# Altium project LightBoard.PrjPcb
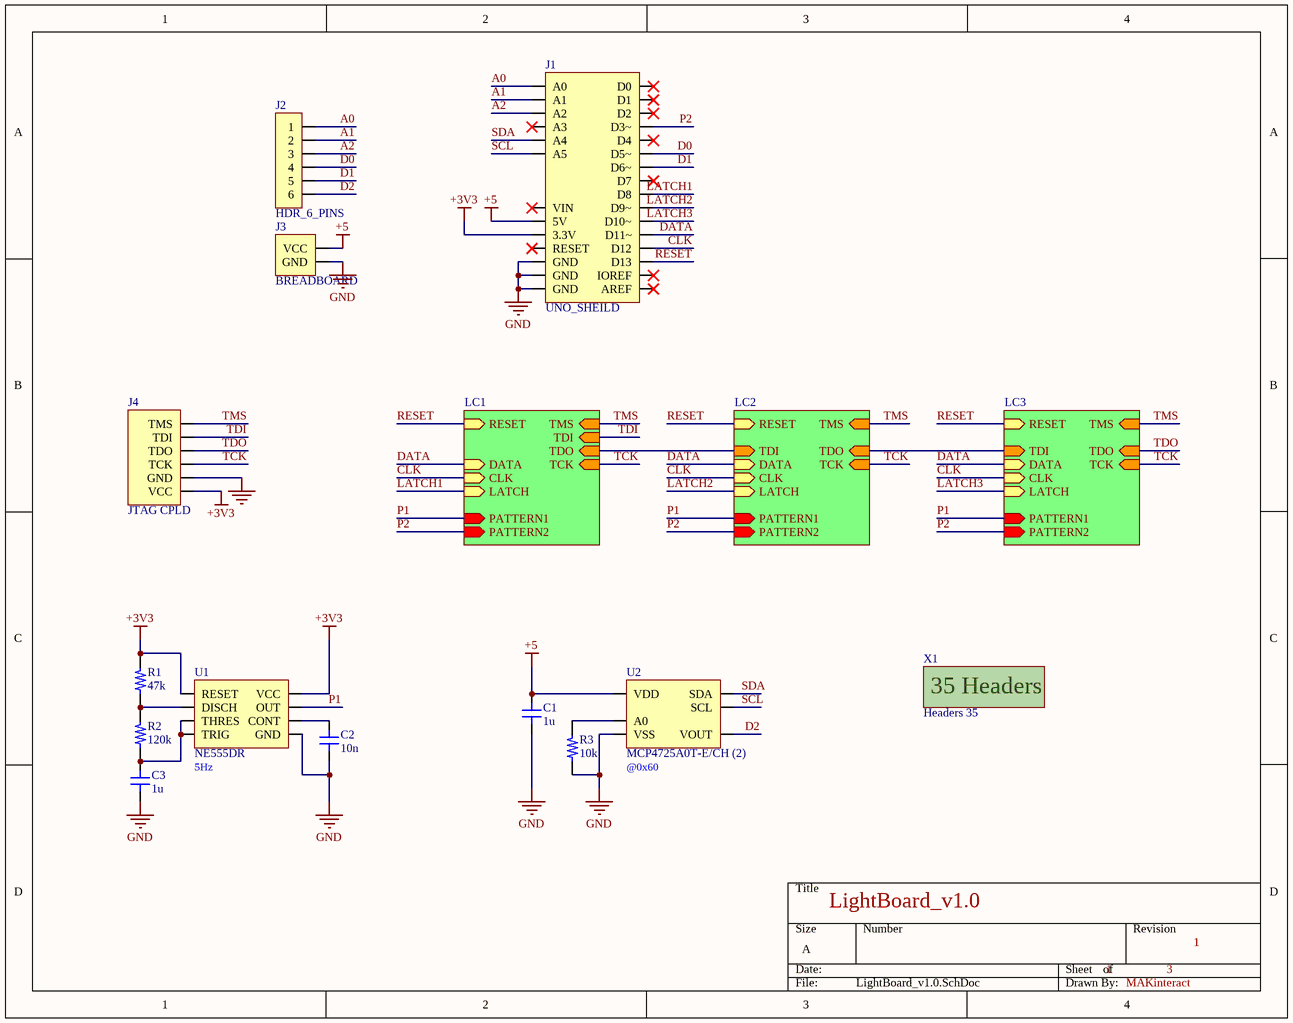
[diagram p0: LightBoard_v1.0.SchDoc]
2 sheets, 145 parts. Net scope: hierarchical (ports join the sheet entries above them; power ports are global).
Board file: LightBoard_v1.0.PcbDoc
Sheets:
  LightBoard_v1.0.SchDoc
    LC1 = LEDcontroller.SchDoc
    LC2 = LEDcontroller.SchDoc
    LC3 = LEDcontroller.SchDoc

## Sheet LightBoard_v1.0.SchDoc
size A; Author: MAKinteract; Revision: 1; SheetNumber: 1; SheetTotal: 3

### Parts
C1  1u
C2  10n
C3  1u
J1  UNO_SHEILD  [ARDUINO_UNO_SHIELD]  (mechanical)
J2  HDR_6_PINS  (mechanical)
J3  BREADBOARD  (mechanical)
J4  JTAG CPLD  (mechanical)
R1  47k
R2  120k
R3  10k
U1  NE555DR
U2  MCP4725A0T-E/CH (2)  [SOT23-6]
X1  Headers 35

### Sub-sheets
LC1 = LEDcontroller.SchDoc: PATTERN1 (in), RESET (in), CLK (in), PATTERN2 (in), TDI (in), TMS (in), TDO (in), TCK (in), DATA (in), LATCH (in)
LC2 = LEDcontroller.SchDoc: PATTERN1 (in), RESET (in), CLK (in), PATTERN2 (in), TDI (in), TMS (in), TDO (in), TCK (in), DATA (in), LATCH (in)
LC3 = LEDcontroller.SchDoc: PATTERN1 (in), RESET (in), CLK (in), PATTERN2 (in), TDI (in), TMS (in), TDO (in), TCK (in), DATA (in), LATCH (in)

### Nets
+3V3: J1.27(3.3V) J4.6(VCC) R1.2 U1.4(RESET) U1.8(VCC)
+5: C1.2 J1.26(5V) J3.1(VCC) U2.3(VDD)
GND: C1.1 C2.1 C3.1 J1.15(GND) J1.24(GND) J1.25(GND) J3.2(GND) J4.5(GND) R3.1 U1.1(GND) U2.2(VSS)
A0: J1.22(A0) J2.1
A1: J1.21(A1) J2.2
A2: J1.20(A2) J2.3
CLK: J1.13(D12) ; sheet LC1/CLK, sheet LC2/CLK, sheet LC3/CLK
D0: J1.6(D5~) J2.4
D1: J1.7(D6~) J2.5
D2: J2.6 U2.1(VOUT)
DATA: J1.12(D11~) ; sheet LC1/DATA, sheet LC2/DATA, sheet LC3/DATA
LATCH1: J1.9(D8) ; sheet LC1/LATCH
LATCH2: J1.10(D9~) ; sheet LC2/LATCH
LATCH3: J1.11(D10~) ; sheet LC3/LATCH
P1: U1.3(OUT) ; sheet LC1/PATTERN1, sheet LC2/PATTERN1, sheet LC3/PATTERN1
P2: J1.4(D3~) ; sheet LC1/PATTERN2, sheet LC2/PATTERN2, sheet LC3/PATTERN2
RESET: J1.14(D13) ; sheet LC1/RESET, sheet LC2/RESET, sheet LC3/RESET
SCL: J1.17(A5) U2.5(SCL)
SDA: J1.18(A4) U2.4(SDA)
TCK: J4.4(TCK) ; sheet LC1/TCK, sheet LC2/TCK, sheet LC3/TCK
TDI: J4.2(TDI) ; sheet LC1/TDI
TDO: J4.3(TDO) ; sheet LC3/TDO
TMS: J4.1(TMS) ; sheet LC1/TMS, sheet LC2/TMS, sheet LC3/TMS
NetC2_2: C2.2 U1.5(CONT)
NetC3_2: C3.2 R2.1 U1.2(TRIG) U1.6(THRES)
NetR1_1: R1.1 R2.2 U1.7(DISCH)
NetR3_2: R3.2 U2.6(A0)
NetU3A_24: sheet LC1/TDO, sheet LC2/TDI
NetU3B_24: sheet LC2/TDO, sheet LC3/TDI

Not connected (* = marked no-connect by the designer): J1 1(D0)* 2(D1)* 3(D2)* 5(D4)* 8(D7)* 16(AREF)* 19(A3)* 23(VIN)* 28(RESET)* 29(IOREF)*

### Notes on the sheet
- (near U1) 5Hz
- (near U2) @0x60
- LightBoard_v1.0
- (in symbol M_Headers35) 35 Headers

### Library data of the parts
C1 C3 = C0805_1u: CERAMIC CAPACITOR, 1UF, 25V, Y5V, +80, -20%, 0805, FULL REEL; Product Range:CC Series; Capacitance:1 F; Capacitance Tolerance:+80%, -20%; Dielectric Characteristic:Y5V; Voltage Rating:25V; Ceramic Capacitor Case:0805 [2012 Metric] ;RoHS Compliant: Yes; Manufacturer: Yageo; Manufacturer Part Number: CC0805ZRY5V8BB105; Tolerance: 80%; Supplier 1: Digi-Key; Stock 1: 144647; RoHS: Yes; Mount: Surface Mount; Case/Package: 0805; Weight: 0.000194oz; Case Code (Metric): 2012; Case Code (Imperial): 0805; Min Operating Temperature: -30°C; Max Operating Temperature: 85°C; Package Quantity: 1; Capacitance: 1uF; Voltage Rating: 25V; Packaging: Tape and Reel; Voltage Rating (DC): 25V; Dielectric: Y5V; Termination: SMD/SMT; Composition: Ceramic; Length: 2mm; Height: 0.85mm; Width: 0.049inch; Thickness: 0.033inch; Depth: 1.25mm; Radiation Hardening: No; REACH SVHC: No SVHC; Lead Free: Lead Free; Halogen Free: Halogen Free; ComponentLink6URL: https://datasheet.ciiva.com/28450/1132289-28450860.pdf?src-supplier=Element14; ComponentLink6Description: https://datasheet.ciiva.com/28450/1132289-28450860.pdf?src-supplier=Element14; Supplier Part Number 1: 311-1358-6-ND; Pricing 1: 1 = 0.16000, 10 = 0.11400, 100 = 0.05340, 500 = 0.03748, 1000 = 0.03102 (USD)
C2 = C0402_10n: Cap Ceramic 0.01uF 10V X7R 10% SMD 0402 125C Paper T/R; Manufacturer: Yageo; Manufacturer Part Number: CC0402KRX7R6BB103; Capacitance: 10nF; Supplier 1: Digi-Key; Stock 1: 16677; RoHS: Yes; Mount: Surface Mount; Case/Package: 0402; Weight: 2.3E-05oz; Case Code (Imperial): 0402; Case Code (Metric): 1005; Min Operating Temperature: -55°C; Max Operating Temperature: 125°C; Packaging: Tape and Reel; Tolerance: 10%; Voltage Rating (DC): 10V; Dielectric: X7R; Termination: SMD/SMT; Composition: Ceramic; Voltage Rating: 10V; Length: 1mm; Width: 0.02inch; Thickness: 0.022inch; Depth: 0.5mm; Radiation Hardening: No; Lead Free: Lead Free; Halogen Free: Halogen Free; ComponentLink1URL: https://datasheet.ciiva.com/26862/getdatasheetpartid-748492-26862629.pdf?src-supplier=Verical; ComponentLink1Description: https://datasheet.ciiva.com/26862/getdatasheetpartid-748492-26862629.pdf?src-supplier=Verical; Supplier Part Number 1: 311-1703-6-ND; Pricing 1: 1 = 0.10000, 10 = 0.02100, 100 = 0.00950, 500 = 0.00678, 1000 = 0.00532, 2500 = 0.00484, 5000 = 0.00445 (USD)
J1 = ARDUINO_UNO_SHIELD: Arduino UNO shield; Manufacturer Part Number: A000073; Evaluation Kit: Yes; Number of Bits: 8; Core Architecture: AVR; Supplier 1: Digi-Key; Manufacturer: Arduino; Stock 1: 2726; RoHS: Yes; Mount: Surface Mount; Weight: 0.02lb; Package Quantity: 1; Packaging: Bulk; Length: 3inch; Height: 0.05inch; Width: 2.5inch; REACH SVHC: Unknown; ComponentLink6URL: https://datasheet.ciiva.com/20168/73-4443-20168541.pdf?src-supplier=Rapid+Electronics; ComponentLink6Description: https://datasheet.ciiva.com/20168/73-4443-20168541.pdf?src-supplier=Rapid+Electronics; Supplier Part Number 1: 1050-1041-ND; Pricing 1: 1 = 20.90000 (USD)
J2 = H_ARDUPINS: Sockets to connect to Arduino pins
J3 = BREADBOARD: 26*2 ROWS
J4 = H_JTAG: Socket to connect to JTAG
R1 = R0402_47K: YAGEO - RC0402JR-0747KL - SMD Chip Resistor, 0402 [1005 Metric], 47 kohm, RC Series, 50 V, Thick Film, 63 mW; Resistance: 47kR; Power Rating: 63mW; Tolerance: 5%; Voltage Rating: 50V; Temperature Coefficient: 100ppm/°C; Supplier 1: Digi-Key; Manufacturer: Yageo; Manufacturer Part Number: RC0402JR-0747KL; Stock 1: 4044309; RoHS: Yes; Case/Package: 0402; Case Code (Metric): 1005; Case Code (Imperial): 0402; Min Operating Temperature: -55°C; Max Operating Temperature: 155°C; Package Quantity: 1; Packaging: Tape and Reel; Composition: Thick Film; Number of Terminations: 2; Termination: SMD/SMT; Military Standard: Not; Max Power Dissipation: 63mW; Features: Moisture Resistant; Working Voltage: 50V; Length: 1mm; Height: 0.016inch; Width: 0.02inch; Depth: 0.5mm; REACH SVHC: Unknown; Lead Free: Lead Free; ComponentLink8URL: https://datasheet.ciiva.com/16740/pyu-rc0402-51-rohs-l-6-r-16740971.pdf?src-supplier=Future+Electronics; ComponentLink8Description: https://datasheet.ciiva.com/16740/pyu-rc0402-51-rohs-l-6-r-16740971.pdf?src-supplier=Future+Electronics; Supplier Part Number 1: 311-47KJRDKR-ND; Pricing 1: 1 = 0.10000, 10 = 0.01300, 100 = 0.00530, 1000 = 0.00236, 2500 = 0.00205, 5000 = 0.00169 (USD)
R2 = R0402_120K: RES SMD 120K OHM 5% 1/16W 0402; Manufacturer: Yageo; Manufacturer Part Number: RC0402JR-07120KL; Resistance: 120kR; Power Rating: 63mW; Voltage Rating: 50V; Temperature Coefficient: 100ppm/°C; Supplier 1: Digi-Key; Stock 1: 102829; RoHS: Yes; Case/Package: 0402; Number of Pins: 2; Case Code (Imperial): 0402; Case Code (Metric): 1005; Min Operating Temperature: -55°C; Max Operating Temperature: 155°C; Tolerance: 5%; Packaging: Tape and Reel; Voltage Rating (DC): 50V; Package Quantity: 10000; Termination: SMD/SMT; Composition: Thick Film; Military Standard: Not; Length: 1mm; Height: 0.35mm; Width: 0.5mm; Depth: 0.5mm; REACH SVHC: No SVHC; Lead Free: Lead Free; ComponentLink1URL: https://datasheet.ciiva.com/7850/1018594-7850140.pdf?src-supplier=Element14; ComponentLink1Description: https://datasheet.ciiva.com/7850/1018594-7850140.pdf?src-supplier=Element14; ComponentLink2URL: https://datasheet.ciiva.com/6168/1018594-6168997.pdf?src-supplier=Farnell; ComponentLink2Description: https://datasheet.ciiva.com/6168/1018594-6168997.pdf?src-supplier=Farnell; ComponentLink3URL: https://datasheet.ciiva.com/7983/1018594-7983545.pdf?src-supplier=Element14; ComponentLink3Description: https://datasheet.ciiva.com/7983/1018594-7983545.pdf?src-supplier=Element14; ComponentLink4URL: https://datasheet.ciiva.com/7850/1018594-7850141.pdf?src-supplier=Element14; ComponentLink4Description: https://datasheet.ciiva.com/7850/1018594-7850141.pdf?src-supplier=Element14; ComponentLink5URL: https://datasheet.ciiva.com/12576/pyu-rc0402-51-rohs-l-6-r-8721-12576174.pdf?src-supplier=Mouser; ComponentLink5Description: https://datasheet.ciiva.com/12576/pyu-rc0402-51-rohs-l-6-r-8721-12576174.pdf?src-supplier=Mouser; Supplier Part Number 1: 311-120KJRDKR-ND; Pricing 1: 1 = 0.10000, 10 = 0.01300, 100 = 0.00530, 1000 = 0.00236, 2500 = 0.00205, 5000 = 0.00169 (USD)
R3 = R0402_10K: RES SMD 10K OHM 1% 1/16W 0402; Manufacturer: Yageo; Manufacturer Part Number: RC0402FR-0710KP; Max Power Dissipation: 63mW; Temperature Coefficient: 150ppm/°C; Resistance: 10kR; Supplier 1: Digi-Key; Stock 1: 24916; RoHS: Yes; Case/Package: 0402; Case Code (Imperial): 0402; Case Code (Metric): 1005; Min Operating Temperature: -55°C; Max Operating Temperature: 155°C; Tolerance: 1%; Packaging: Tape and Reel; Composition: Thick Film; Number of Terminations: 2; Features: Moisture Resistant; Length: 0.039inch; Height: 0.016inch; Width: 0.02inch; ComponentLink1URL: http://www.yageo.com/NewPortal/yageodocoutput?fileName=/pdf/R-Chip/PYu-RC_51_RoHS_P_0.pdf&src-supplier=Digi-Key; ComponentLink1Description: http://www.yageo.com/NewPortal/yageodocoutput?fileName=/pdf/R-Chip/PYu-RC_51_RoHS_P_0.pdf&src-supplier=Digi-Key; Supplier Part Number 1: YAG1249DKR-ND; Pricing 1: 1 = 0.10000, 10 = 0.03500, 100 = 0.01400, 1000 = 0.00631, 2500 = 0.00548, 5000 = 0.00452 (USD)
U1 = 555: TEXAS INSTRUMENTS         NE555DR.             TIMER, SINGLE, 500KHZ, 16V, SOIC-8; Min Supply Voltage: 4.5V; Frequency: 100kHz; Number of Timers/Counters: 1; Operating Supply Current: 10mA; High Level Output Current: -200mA; Low Level Output Current: 200mA; Quiescent Current: 15mA; Supplier 1: Digi-Key; Manufacturer: Texas Instruments; Manufacturer Part Number: NE555DR; Stock 1: 55105; RoHS: Yes; Mount: Surface Mount; Case/Package: SOIC; Number of Pins: 8; Weight: 0.002561oz; Contact Plating: Gold; Min Operating Temperature: 0°C; Max Operating Temperature: 70°C; Max Supply Voltage: 16V; Packaging: Tape and Reel; Package Quantity: 2500; Length: 4.9mm; Height: 1.58mm; Width: 3.91mm; Radiation Hardening: No; REACH SVHC: No SVHC; Lead Free: Lead Free; Supplier Part Number 1: 296-6501-6-ND; Pricing 1: 1 = 0.36000, 10 = 0.27500, 25 = 0.24760, 100 = 0.17100, 250 = 0.14400, 500 = 0.11700, 1000 = 0.09000 (USD); ComponentLink7URL: https://datasheet.ciiva.com/1139/1874740-1139901.pdf?src-supplier=Element14; ComponentLink7Description: https://datasheet.ciiva.com/1139/1874740-1139901.pdf?src-supplier=Element14
U2 = MCP4725A0T: DAC 1-CH Resistor-String 12-bit 6-Pin SOT-23A T/R; Manufacturer: Microchip; Resolution: 12b; Integral Nonlinearity (INL): 14.5LSB; Output Type: Voltage; Interface: I2C,Serial,2-Wire; Settling Time: 6us; Input Offset Voltage (Vos): 1.1mV; Number of Bits: 12; Number of DAC Channels: 1; Max Supply Voltage: 5.5V; Min Supply Voltage: 2.7V; Polarity: Unipolar; Supply Type: Single; Nominal Supply Current: 210uA; Supplier 1: Digi-Key; Manufacturer Part Number: MCP4725A0T-E/CH; Stock 1: 26487; RoHS: Yes; Mount: Surface Mount; Case/Package: SOT-23-6; Number of Pins: 6; Contact Plating: Tin,Matte; Min Operating Temperature: -40°C; Max Operating Temperature: 125°C; Package Quantity: 3000; Packaging: Tape and Reel; Number of Converters: 1; Number of Channels: 1; Number of D/A Converters: 1; Number of Outputs: 1; Termination: SMD/SMT; Length: 3.1mm; Height: 1.3mm; Width: 1.8mm; Radiation Hardening: No; Lead Free: Lead Free; REACH SVHC: No SVHC; ComponentLink10URL: https://datasheet.ciiva.com/1359/22039d-1359789.pdf?src-supplier=Digi-Key; ComponentLink10Description: https://datasheet.ciiva.com/1359/22039d-1359789.pdf?src-supplier=Digi-Key; Supplier Part Number 1: MCP4725A0T-E/CHDKR-ND; Pricing 1: 1 = 0.96000, 25 = 0.80000, 100 = 0.73000 (USD)
X1 = M_Headers35: Conn Header Vert 35POS 2.54MM; Manufacturer: Preci-Dip; Manufacturer Part Number: 890-70-035-10-001101; Connector Type: Male Pin; Number of Positions: 35; Pitch: 0.1inch; Supplier 1: Digi-Key; Stock 1: 0; RoHS: Yes; Mount: Through Hole; Contact Plating: Gold; Color: Black; Termination: Solder; Package Quantity: 590; Packaging: Bulk; Number of Rows: 1; Contact Mating Length: 0.236inch; ComponentLink1URL: https://datasheet.ciiva.com/18660/catalog-18660493.pdf?src-supplier=Digi-Key; ComponentLink1Description: https://datasheet.ciiva.com/18660/catalog-18660493.pdf?src-supplier=Digi-Key; Supplier Part Number 1: S1011EC-35-ND; Pricing 1: 1 = 0.79000, 10 = 0.69100, 25 = 0.65000, 50 = 0.62300, 100 = 0.59600, 250 = 0.54180, 500 = 0.48762 (USD); ComponentLink2URL: https://datasheet.ciiva.com/741/xrxczzzsxxn-rc-st-11635-b-741210.pdf?src-supplier=Digi-Key; ComponentLink2Description: https://datasheet.ciiva.com/741/xrxczzzsxxn-rc-st-11635-b-741210.pdf?src-supplier=Digi-Key

## Sheet LEDcontroller.SchDoc
size A; Author: MAKinteract; Revision: 1; SheetNumber: 2; SheetTotal: 3
Used 3 times, as channels LC1, LC2, LC3. Parts and nets are listed once, with the designators drawn on the sheet.
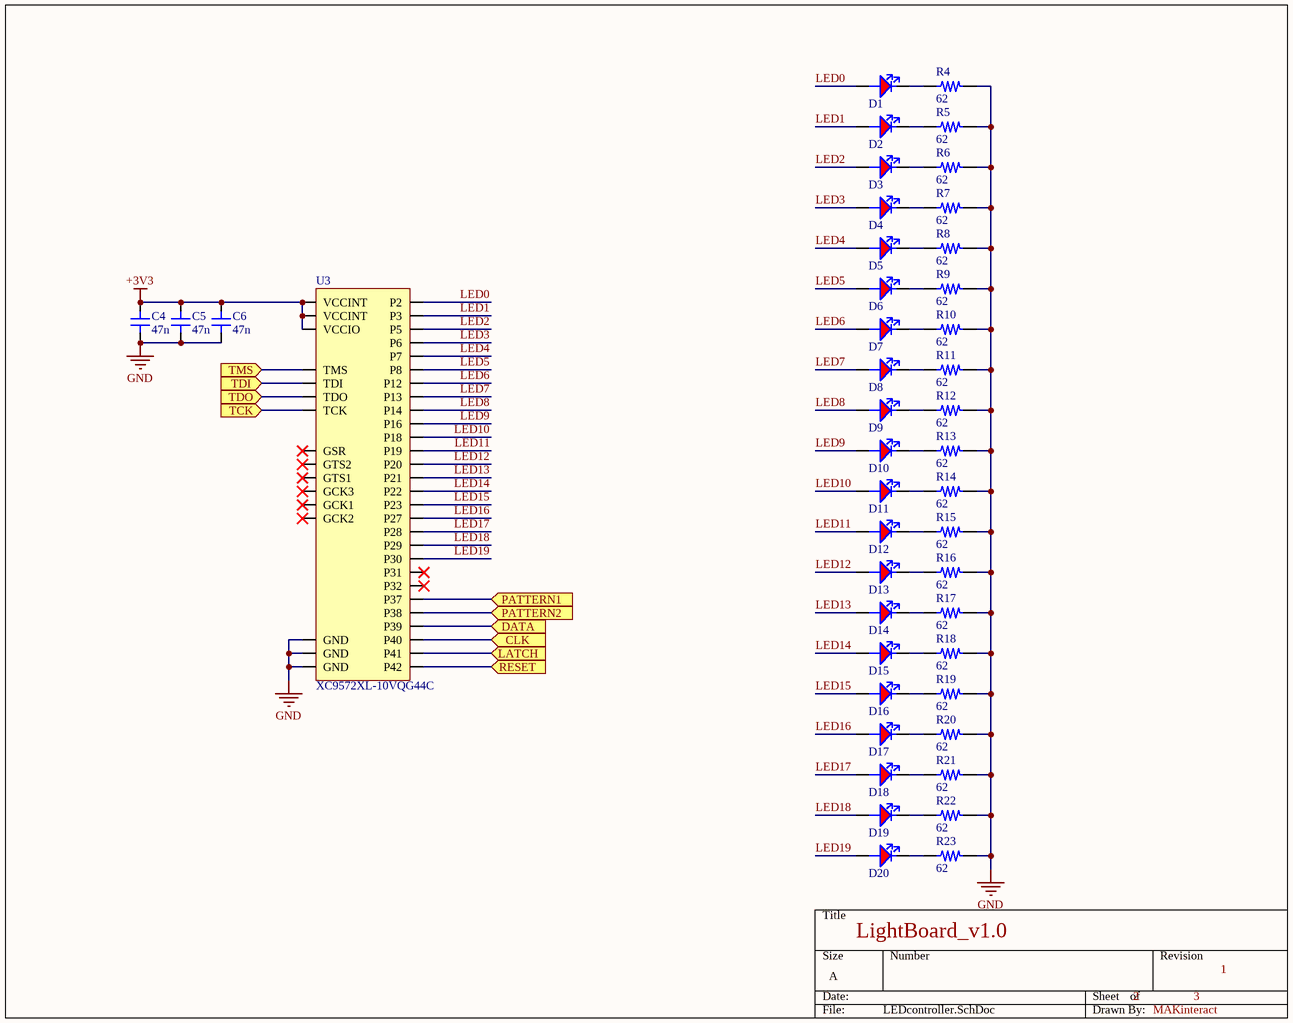
[diagram p1: LEDcontroller.SchDoc]

### Parts
C4  47n
C5  47n
C6  47n
D1  LED0402_RED  (value not drawn)
D2  LED0402_RED  (value not drawn)
D3  LED0402_RED  (value not drawn)
D4  LED0402_RED  (value not drawn)
D5  LED0402_RED  (value not drawn)
D6  LED0402_RED  (value not drawn)
D7  LED0402_RED  (value not drawn)
D8  LED0402_RED  (value not drawn)
D9  LED0402_RED  (value not drawn)
D10  LED0402_RED  (value not drawn)
D11  LED0402_RED  (value not drawn)
D12  LED0402_RED  (value not drawn)
D13  LED0402_RED  (value not drawn)
D14  LED0402_RED  (value not drawn)
D15  LED0402_RED  (value not drawn)
D16  LED0402_RED  (value not drawn)
D17  LED0402_RED  (value not drawn)
D18  LED0402_RED  (value not drawn)
D19  LED0402_RED  (value not drawn)
D20  LED0402_RED  (value not drawn)
R4  62
R5  62
R6  62
R7  62
R8  62
R9  62
R10  62
R11  62
R12  62
R13  62
R14  62
R15  62
R16  62
R17  62
R18  62
R19  62
R20  62
R21  62
R22  62
R23  62
U3  XC9572XL-10VQG44C

### Ports
CLK (in), DATA (in), LATCH (in), PATTERN1 (in), PATTERN2 (in), RESET (in), TCK (in), TDI (in), TDO (in), TMS (in)

### Nets
+3V3: C4.2 C5.2 C6.2 U3.15(VCCINT) U3.26(VCCIO) U3.35(VCCINT)
GND: C4.1 C5.1 C6.1 R4.2 R5.2 R6.2 R7.2 R8.2 R9.2 R10.2 R11.2 R12.2 R13.2 R14.2 R15.2 R16.2 R17.2 R18.2 R19.2 R20.2 R21.2 R22.2 R23.2 U3.4(GND) U3.17(GND) U3.25(GND)
CLK: U3.40(P40) ; port CLK
DATA: U3.39(P39) ; port DATA
LATCH: U3.41(P41) ; port LATCH
LED0: D1.1(A) U3.2(P2)
LED1: D2.1(A) U3.3(P3)
LED2: D3.1(A) U3.5(P5)
LED3: D4.1(A) U3.6(P6)
LED4: D5.1(A) U3.7(P7)
LED5: D6.1(A) U3.8(P8)
LED6: D7.1(A) U3.12(P12)
LED7: D8.1(A) U3.13(P13)
LED8: D9.1(A) U3.14(P14)
LED9: D10.1(A) U3.16(P16)
LED10: D11.1(A) U3.18(P18)
LED11: D12.1(A) U3.19(P19)
LED12: D13.1(A) U3.20(P20)
LED13: D14.1(A) U3.21(P21)
LED14: D15.1(A) U3.22(P22)
LED15: D16.1(A) U3.23(P23)
LED16: D17.1(A) U3.27(P27)
LED17: D18.1(A) U3.28(P28)
LED18: D19.1(A) U3.29(P29)
LED19: D20.1(A) U3.30(P30)
PATTERN1: U3.37(P37) ; port PATTERN1
PATTERN2: U3.38(P38) ; port PATTERN2
RESET: U3.42(P42) ; port RESET
TCK: U3.11(TCK) ; port TCK
TDI: U3.9(TDI) ; port TDI
TDO: U3.24(TDO) ; port TDO
TMS: U3.10(TMS) ; port TMS
NetD1_2: D1.2(K) R4.1
NetD2_2: D2.2(K) R5.1
NetD3_2: D3.2(K) R6.1
NetD4_2: D4.2(K) R7.1
NetD5_2: D5.2(K) R8.1
NetD6_2: D6.2(K) R9.1
NetD7_2: D7.2(K) R10.1
NetD8_2: D8.2(K) R11.1
NetD9_2: D9.2(K) R12.1
NetD10_2: D10.2(K) R13.1
NetD11_2: D11.2(K) R14.1
NetD12_2: D12.2(K) R15.1
NetD13_2: D13.2(K) R16.1
NetD14_2: D14.2(K) R17.1
NetD15_2: D15.2(K) R18.1
NetD16_2: D16.2(K) R19.1
NetD17_2: D17.2(K) R20.1
NetD18_2: D18.2(K) R21.1
NetD19_2: D19.2(K) R22.1
NetD20_2: D20.2(K) R23.1

Not connected (* = marked no-connect by the designer): U3 1(GCK3)* 31(P31)* 32(P32)* 33(GSR)* 34(GTS2)* 36(GTS1)* 43(GCK1)* 44(GCK2)*

### Channels
LC1: designators end in A; ports CLK=CLK DATA=DATA LATCH=LATCH1 PATTERN1=P1 PATTERN2=P2 RESET=RESET TCK=TCK TDI=TDI TDO=NetU3A_24 TMS=TMS
LC2: designators end in B; ports CLK=CLK DATA=DATA LATCH=LATCH2 PATTERN1=P1 PATTERN2=P2 RESET=RESET TCK=TCK TDI=NetU3A_24 TDO=NetU3B_24 TMS=TMS
LC3: designators end in C; ports CLK=CLK DATA=DATA LATCH=LATCH3 PATTERN1=P1 PATTERN2=P2 RESET=RESET TCK=TCK TDI=NetU3B_24 TDO=TDO TMS=TMS

### Notes on the sheet
- LightBoard_v1.0

### Library data of the parts
C4-C6 = C0805_47n: Cap Ceramic 0.047uF 50V X7R 5% SMD 0805 125C Paper T/R; Manufacturer: Yageo; Manufacturer Part Number: CC0805JRX7R9BB473; Capacitance: 47nF; Supplier 1: Digi-Key; Stock 1: 8317; RoHS: Yes; Mount: Surface Mount; Case/Package: 0805; Weight: 0.000194oz; Case Code (Imperial): 0805; Case Code (Metric): 2012; Min Operating Temperature: -55°C; Max Operating Temperature: 125°C; Tolerance: 5%; Voltage Rating: 50V; Voltage Rating (DC): 50V; Packaging: Tape and Reel; Dielectric: X7R; Termination: SMD/SMT; Composition: Ceramic; Length: 2mm; Height: 0.85mm; Width: 1.25mm; Thickness: 0.037inch; Depth: 1.25mm; Radiation Hardening: No; Lead Free: Lead Free; Halogen Free: Halogen Free; ComponentLink4URL: https://datasheet.ciiva.com/11587/upy-gphc-x7r-6-3v-to-50v-8-11587207.pdf?src-supplier=Avnet; ComponentLink4Description: https://datasheet.ciiva.com/11587/upy-gphc-x7r-6-3v-to-50v-8-11587207.pdf?src-supplier=Avnet; Supplier Part Number 1: 311-3553-6-ND; Pricing 1: 1 = 0.21000, 10 = 0.14700, 100 = 0.06900, 500 = 0.04838, 1000 = 0.04005 (USD)
D1-D20 = LED0402_RED: Led red; Manufacturer: Everlight; Manufacturer Part Number: EAST1005BA0; Color: Blue; Lens Color: Colorless; Lens Transparency: Clear; Luminous Intensity: 50mcd; Test Current: 5mA; Viewing Angle: 120°; Dominant Wavelength: 471nm; Forward Voltage: 3.3V; Number of LEDs: 1; Forward Current: 30mA; Power Rating: 75mW; Wavelength: 631nm; Lens Style: Rectangular,Square; Description: Led Blue Clear 2SMD; RoHS: Yes; Mount: Surface Mount; Case/Package: 0402; Packaging: Tape and Reel; Length: 1mm; Height: 0.45mm; Width: 0.5mm; Supplier 1: Digi-Key; Stock 1: 50832; Number of Pins: 2; Case Code (Imperial): 0402; Case Code (Metric): 1005; Min Operating Temperature: -30°C; Max Operating Temperature: 85°C; Package Quantity: 1; Illumination Color: Red; Radiation Hardening: No; Lead Free: Lead Free; REACH SVHC: Unknown; ComponentLink3URL: https://datasheet.ciiva.com/13945/vlmo1500-13945367.pdf?src-supplier=Digi-Key; ComponentLink3Description: https://datasheet.ciiva.com/13945/vlmo1500-13945367.pdf?src-supplier=Digi-Key; Supplier Part Number 1: VLMS1500-GS08DKR-ND; Pricing 1: 1 = 0.48000, 10 = 0.34600, 100 = 0.15360, 500 = 0.10752, 1000 = 0.08832 (USD)
R4-R23 = R0402_62: RES SMD 62 OHM 1% 1/16W 0402; Manufacturer: Yageo; Manufacturer Part Number: RC0402FR-0762RL; Resistance: 62R; Temperature Coefficient: 100ppm/°C; Voltage Rating (DC): 50V; Power Rating: 63mW; Supplier 1: Digi-Key; Stock 1: 193361; RoHS: Yes; Case/Package: 0402; Case Code (Imperial): 0402; Case Code (Metric): 1005; Min Operating Temperature: -55°C; Max Operating Temperature: 155°C; Packaging: Tape and Reel; Tolerance: 1%; Composition: Thick Film; Voltage Rating: 50V; Termination: SMD/SMT; Military Standard: Not; Length: 1mm; Height: 0.35mm; Width: 0.5mm; Depth: 0.5mm; REACH SVHC: Unknown; Lead Free: Lead Free; ComponentLink1URL: https://datasheet.ciiva.com/17086/pyu-rc0402-51-rohs-l-6-r-17086553.pdf?src-supplier=Future+Electronics; ComponentLink1Description: https://datasheet.ciiva.com/17086/pyu-rc0402-51-rohs-l-6-r-17086553.pdf?src-supplier=Future+Electronics; Supplier Part Number 1: 311-62.0LRDKR-ND; Pricing 1: 1 = 0.10000, 10 = 0.01600, 100 = 0.00640, 1000 = 0.00289, 2500 = 0.00251, 5000 = 0.00207 (USD)
U3 = XC9572XL: XILINX - XC9572XL-10VQG44C. - CPLD, 72 MACROCELL, 3.3V, 44VQFP; Propagation Delay: 10ns; Speed Grade: 10; Min Supply Voltage: 3V; Max Supply Voltage: 3.6V; Frequency: 178MHz; Number of Gates: 1600; Number of Logic Blocks (LABs): 4; Number of Macrocells: 72; Number of I/Os: 34; Memory Type: FLASH; Max Frequency: 100MHz; Supplier 1: Digi-Key; Manufacturer: Xilinx; Manufacturer Part Number: XC9572XL-10VQG44C; Stock 1: 4319; RoHS: Yes; Mount: Surface Mount; Case/Package: TQFP; Number of Pins: 44; Min Operating Temperature: 0°C; Max Operating Temperature: 70°C; Packaging: Tray; Operating Supply Voltage: 3.3V; Package Quantity: 160; Number of Logic Elements/Cells: 4; Termination: SMD/SMT; Turn-On Delay Time: 10ns; Radiation Hardening: No; REACH SVHC: No SVHC; Lead Free: Lead Free; ComponentLink3URL: https://datasheet.ciiva.com/1407/ds057-1407687.pdf?src-supplier=Digi-Key; ComponentLink3Description: https://datasheet.ciiva.com/1407/ds057-1407687.pdf?src-supplier=Digi-Key; Supplier Part Number 1: 122-1448-ND; Pricing 1: 1 = 3.71000 (USD)

## Nets that join several sheets
+3V3: LightBoard_v1.0 (5 pins), LC1 (6 pins), LC2 (6 pins), LC3 (6 pins)
GND: LightBoard_v1.0 (11 pins), LC1 (26 pins), LC2 (26 pins), LC3 (26 pins)
CLK: LightBoard_v1.0 (J1.13), LC1 (U3A.40), LC2 (U3B.40), LC3 (U3C.40)
DATA: LightBoard_v1.0 (J1.12), LC1 (U3A.39), LC2 (U3B.39), LC3 (U3C.39)
LATCH1: LightBoard_v1.0 (J1.9), LC1 (U3A.41)
LATCH2: LightBoard_v1.0 (J1.10), LC2 (U3B.41)
LATCH3: LightBoard_v1.0 (J1.11), LC3 (U3C.41)
NetU3A_24: LC1 (U3A.24), LC2 (U3B.9)
NetU3B_24: LC2 (U3B.24), LC3 (U3C.9)
P1: LightBoard_v1.0 (U1.3), LC1 (U3A.37), LC2 (U3B.37), LC3 (U3C.37)
P2: LightBoard_v1.0 (J1.4), LC1 (U3A.38), LC2 (U3B.38), LC3 (U3C.38)
RESET: LightBoard_v1.0 (J1.14), LC1 (U3A.42), LC2 (U3B.42), LC3 (U3C.42)
TCK: LightBoard_v1.0 (J4.4), LC1 (U3A.11), LC2 (U3B.11), LC3 (U3C.11)
TDI: LightBoard_v1.0 (J4.2), LC1 (U3A.9)
TDO: LightBoard_v1.0 (J4.3), LC3 (U3C.24)
TMS: LightBoard_v1.0 (J4.1), LC1 (U3A.10), LC2 (U3B.10), LC3 (U3C.10)